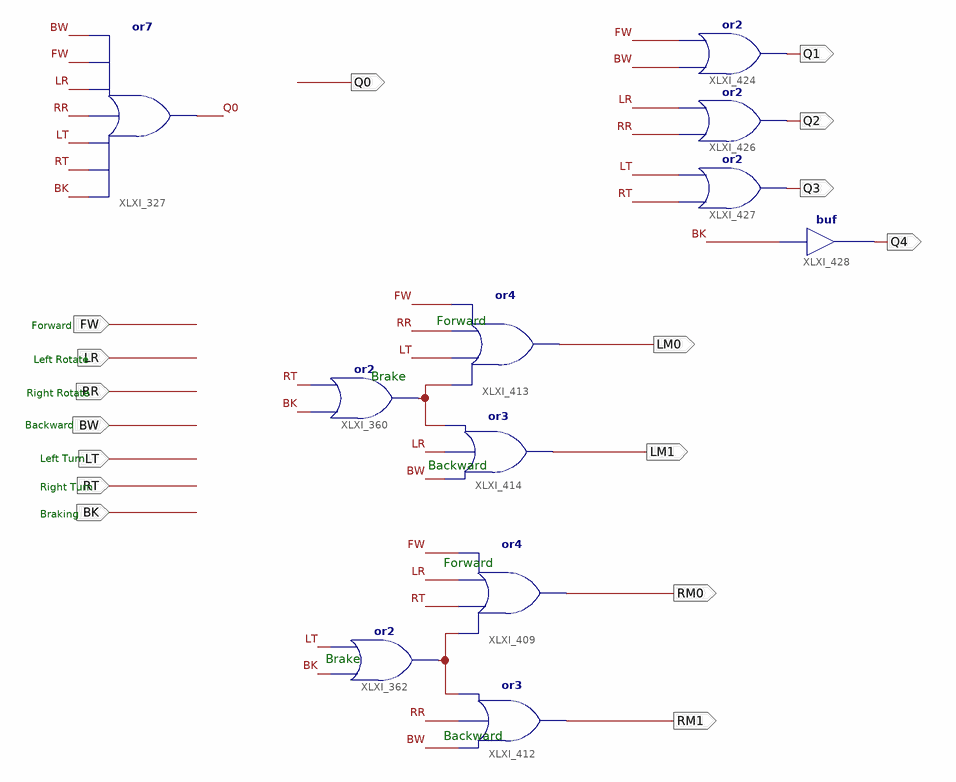
[diagram p0: schematic sheet 1]
// Xilinx ISE schematic Control.sch (xc9500xl) as structural Verilog: 11 symbols, 16 ports
module Control (
  input  LR,
  input  RR,
  input  BW,
  input  LT,
  input  RT,
  input  BK,
  input  FW,
  output LM0,
  output LM1,
  output RM0,
  output RM1,
  output Q0,
  output Q1,
  output Q2,
  output Q3,
  output Q4
);

  wire LMB, XLXN_1512;

  or XLXI_409 (RM0, XLXN_1512, RT, LR, FW);
  or XLXI_412 (RM1, BW, RR, XLXN_1512);
  or XLXI_362 (XLXN_1512, BK, LT);
  or XLXI_413 (LM0, LMB, LT, RR, FW);
  or XLXI_414 (LM1, BW, LR, LMB);
  or XLXI_360 (LMB, BK, RT);
  or XLXI_327 (Q0, BK, RT, LT, RR, LR, FW, BW);
  or XLXI_424 (Q1, BW, FW);
  or XLXI_426 (Q2, RR, LR);
  or XLXI_427 (Q3, RT, LT);
  buf XLXI_428 (Q4, BK);

  // Notes on the sheet:
  //   Forward
  //   Forward
  //   Left Rotate
  //   Brake
  //   Right Rotate
  //   Backward
  //   Left Turn
  //   Backward
  //   Right Turn
  //   Braking
  //   Forward
  //   Brake
  //   Backward
endmodule
